# Altium schematic sheet BLOCK_DIA.SchDoc
size A4
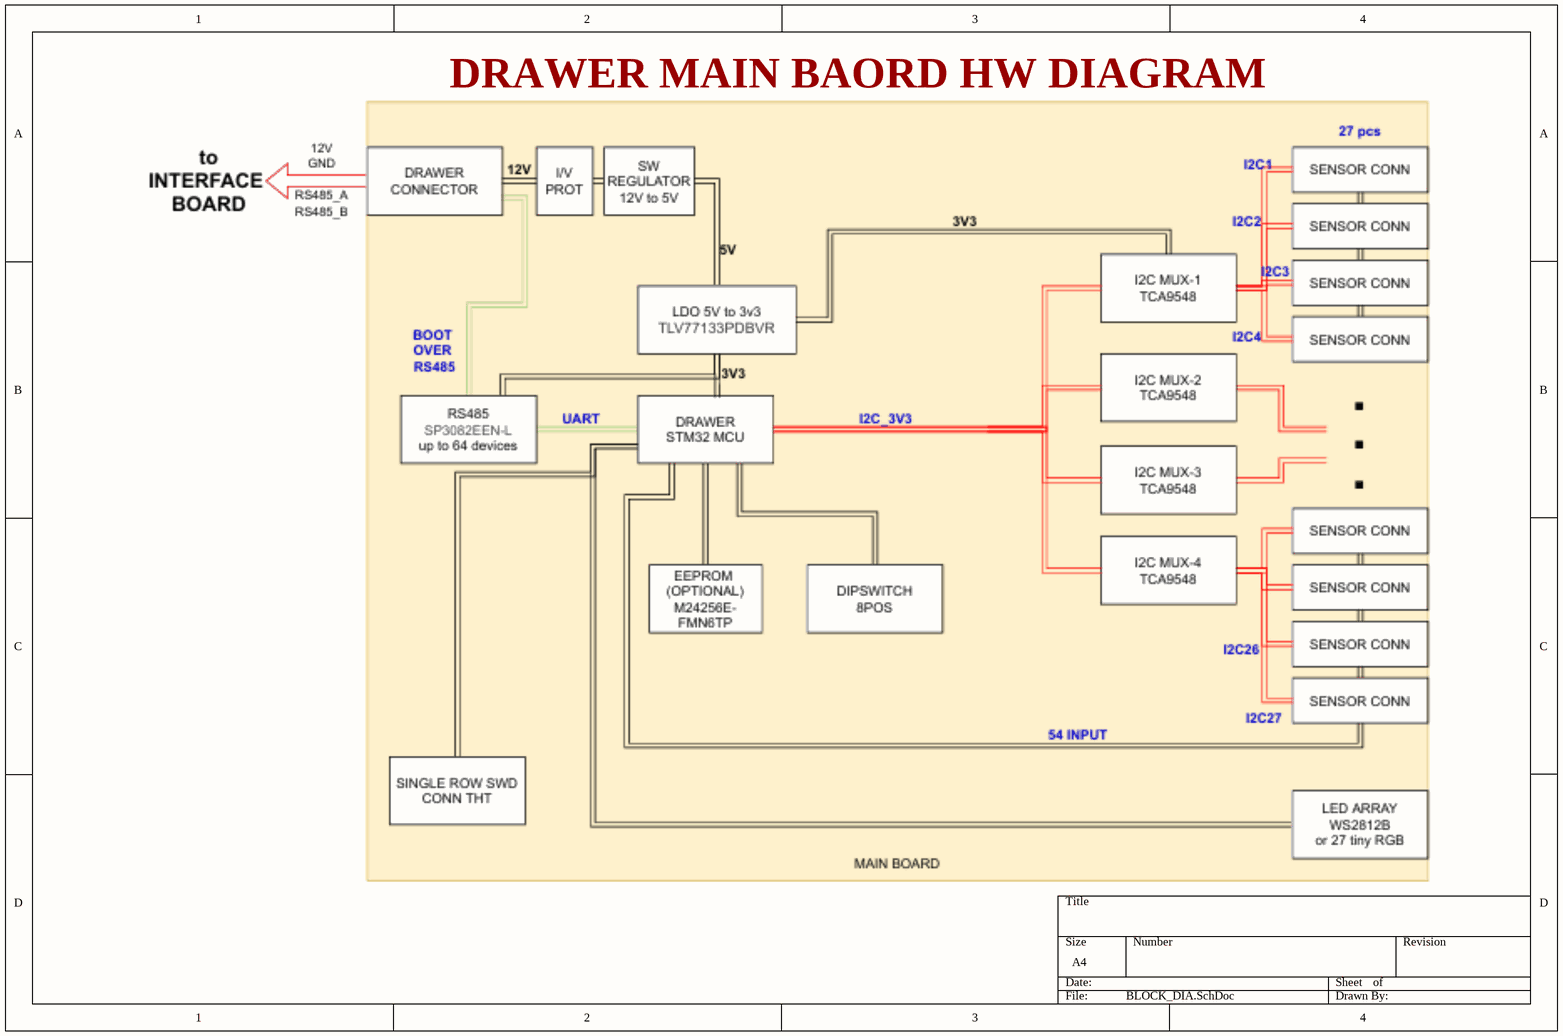
[diagram p0: BLOCK_DIA.SchDoc]

## Notes on the sheet
- DRAWER MAIN BAORD HW DIAGRAM